# EAGLE design CC3200MOD (EAGLE 7.1.0)
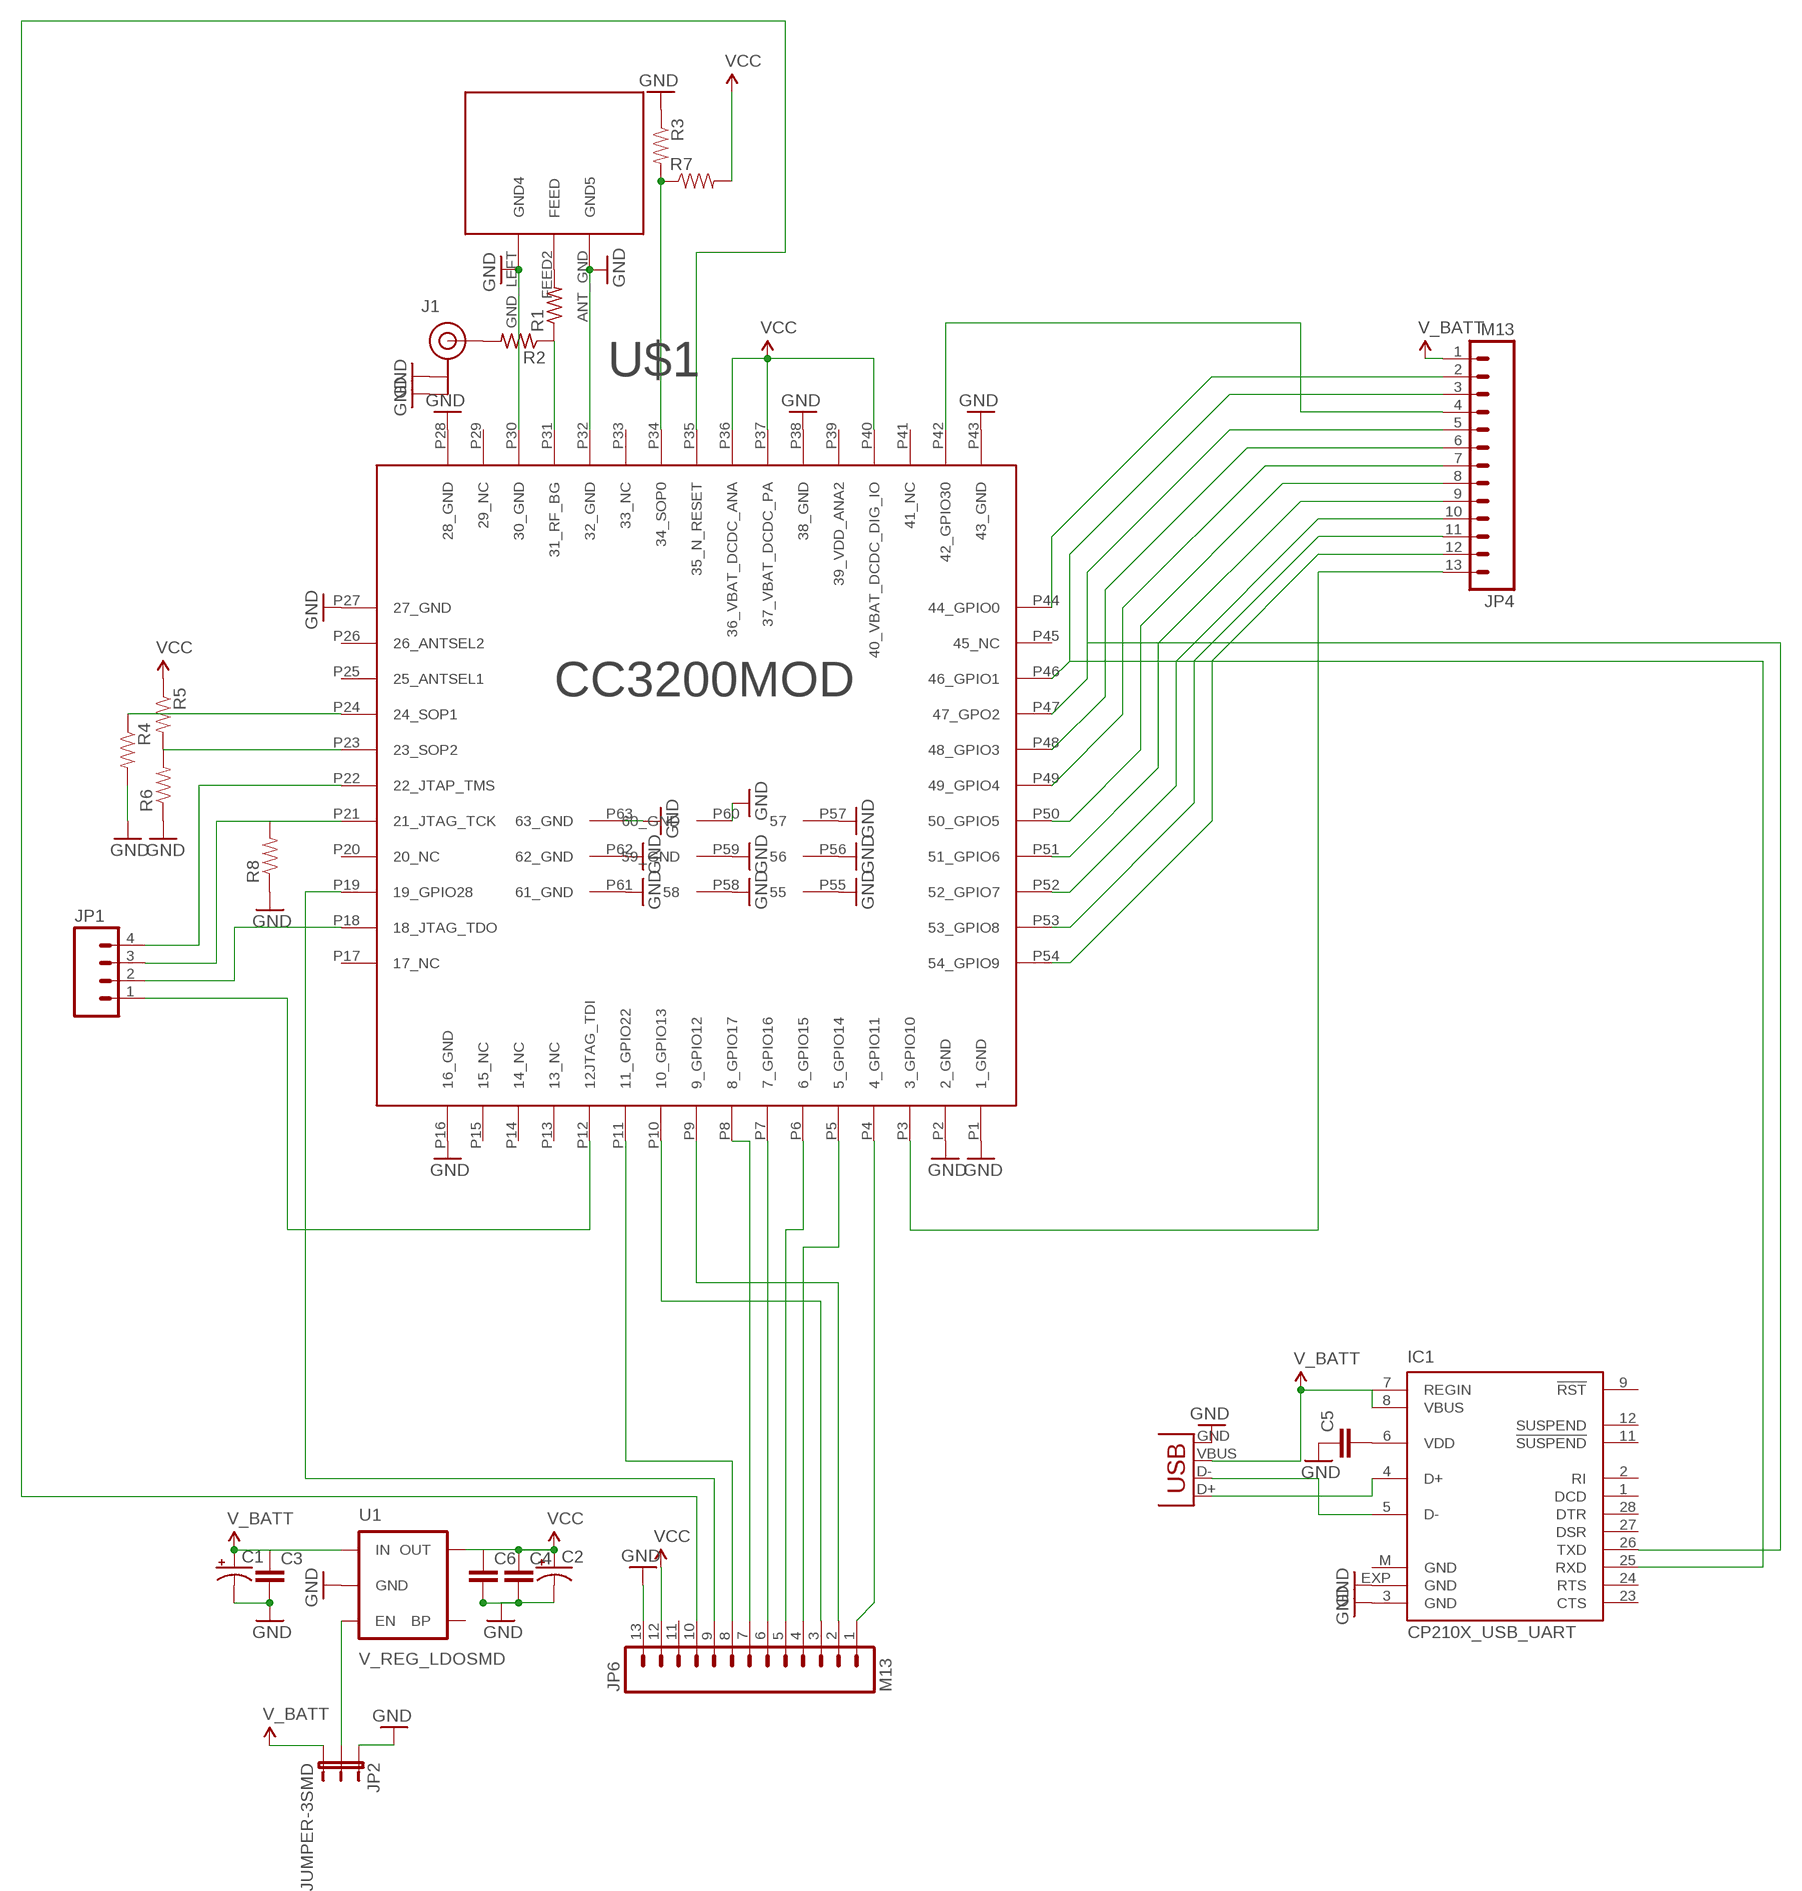
[diagram p0: schematic, sheet 1]

## Parts
C1  CAP_POL1206  [EIA3216]
C2  CAP_POL1206  [EIA3216]
C3  CAP0805  [0805]
C4  CAP0805  [0805]
C5  CAP0805  [0805]
C6  CAP0805  [0805]
IC1  CP210X_USB_UART  [MLP28]
J1  U.FL  [U.FL]
JP1  M041.27MM  [1X04-1.27MM]
JP2  JUMPER-3SMD  [SJ_3]
JP4  M13  [1X13]
JP5  USBSMD  [USB-MINIB]
JP6  M13  [1X13]
R1  R-US_R0402  [R0402]
R2  R-US_R0402  [R0402]
R3  RESISTOR0805-RES  [0805]
R4  RESISTOR0805-RES  [0805]
R5  RESISTOR0805-RES  [0805]
R6  RESISTOR0805-RES  [0805]
R7  RESISTOR0805-RES  [0805]
R8  RESISTOR0805-RES  [0805]
U1  V_REG_LDOSMD  [SOT23-5]
U$1  CC3200  [CC3200MOD]
U$2  ANT  [ANT]

## Nets
GND [power]: C1.C(-) C2.C(-) C3.2 C4.2 C5.1 C6.2 IC1.3(GND) IC1.EXP(GND) J1.P$1(GND) J1.P$2(GND) JP2.1 JP5.GND JP6.13 R3.1 R4.2 R6.1 R8.1 U1.2(GND) U$1.P1(1_GND) U$1.P2(2_GND) U$1.P16(16_GND) U$1.P27(27_GND) U$1.P28(28_GND) U$1.P30(30_GND) U$1.P32(32_GND) U$1.P38(38_GND) U$1.P43(43_GND) U$1.P55 U$1.P56 U$1.P57 U$1.P58 U$1.P59(59_GND) U$1.P60(60_GND) U$1.P61(61_GND) U$1.P62(62_GND) U$1.P63(63_GND) U$2.ANT_GND(GND5) U$2.GND_LEFT(GND4)
N$1: R1.2 U$2.FEED2(FEED)
N$2: JP1.3 R8.2 U$1.P21(21_JTAG_TCK)
N$3: JP1.4 U$1.P22(22_JTAP_TMS)
N$4: R1.1 R2.1 U$1.P31(31_RF_BG)
N$5: J1.P$3(SIGNAL) R2.2
N$6: R4.1 U$1.P24(24_SOP1)
N$7: JP4.2 U$1.P44(44_GPIO0)
N$8: R3.2 R7.1 U$1.P34(34_SOP0)
N$9: JP1.2 U$1.P18(18_JTAG_TDO)
N$10: JP1.1 U$1.P12(12JTAG_TDI)
N$11: R5.2 R6.2 U$1.P23(23_SOP2)
N$12: IC1.25(RXD) JP4.3 U$1.P46(46_GPIO1)
N$13: IC1.26(TXD) JP4.5 U$1.P47(47_GPO2)
N$14: JP4.6 U$1.P48(48_GPIO3)
N$15: JP4.7 U$1.P49(49_GPIO4)
N$16: JP4.8 U$1.P50(50_GPIO5)
N$17: JP4.9 U$1.P51(51_GPIO6)
N$18: JP4.10 U$1.P52(52_GPIO7)
N$19: JP4.11 U$1.P53(53_GPIO8)
N$20: JP4.12 U$1.P54(54_GPIO9)
N$21: JP4.13 U$1.P3(3_GPIO10)
N$22: IC1.4(D+) JP5.D+
N$23: JP6.2 U$1.P9(9_GPIO12)
N$24: JP2.2 U1.3(EN)
N$25: JP4.4 U$1.P42(42_GPIO30)
N$26: JP6.4 U$1.P5(5_GPIO14)
N$27: JP6.5 U$1.P6(6_GPIO15)
N$28: JP6.1 U$1.P4(4_GPIO11)
N$29: JP6.6 U$1.P7(7_GPIO16)
N$30: IC1.5(D-) JP5.D-
N$31: JP6.10 U$1.P35(35_N_RESET)
N$32: JP6.9 U$1.P19(19_GPIO28)
N$33: JP6.7 U$1.P8(8_GPIO17)
N$35: JP6.8 U$1.P11(11_GPIO22)
N$37: C5.2 IC1.6(VDD)
N$38: JP6.3 U$1.P10(10_GPIO13)
V_BATT [power]: C1.A(+) C3.1 IC1.7(REGIN) IC1.8(VBUS) JP2.3 JP4.1 JP5.VBUS U1.1(IN)
VCC [power]: C2.A(+) C4.1 C6.1 JP6.12 R5.1 R7.2 U1.5(OUT) U$1.P36(36_VBAT_DCDC_ANA) U$1.P37(37_VBAT_DCDC_PA) U$1.P40(40_VBAT_DCDC_DIG_IO)
Unconnected: IC1.1(DCD) IC1.2(RI) IC1.9(!RST) IC1.11(!SUSPEND) IC1.12(SUSPEND) IC1.23(CTS) IC1.24(RTS) IC1.27(DSR) IC1.28(DTR) JP6.11 U1.4(BP) U$1.P13(13_NC) U$1.P14(14_NC) U$1.P15(15_NC) U$1.P17(17_NC) U$1.P20(20_NC) U$1.P25(25_ANTSEL1) U$1.P26(26_ANTSEL2) U$1.P29(29_NC) U$1.P33(33_NC) U$1.P39(39_VDD_ANA2) U$1.P41(41_NC) U$1.P45(45_NC)

## Power pins joined to a net without a drawn wire
GND: IC1.M(GND)

## Library data of the parts
C1 C2 = SparkFun-Passives:CAP_POL: Capacitor Polarized These are standard SMD and PTH capacitors. Normally 10uF, 47uF, and 100uF in electrolytic and tantalum varieties. Always verify the external diameter of the through hole cap, it varies with capacity, voltage, and manufacturer. The EIA devices should be standard.
C3-C6 = SparkFun-Passives:CAP: Capacitor Standard 0603 ceramic capacitor, and 0.1" leaded capacitor.
IC1 = SparkFun-DigitalIC:CP210X_USB_UART: Single-Chip USB to UART Bridge Source: www.silabs.com .. CP2101.pdf / cp2102.pdf. Spark Fun Electronics SKU : COM-00310
J1 = SparkFun-Connectors:U.FL: SMD antenna connector- WRL-09144
JP1 = SparkFun-Connectors:M04: Header 4 Standard 4-pin 0.1" header. Use with straight break away headers (SKU : PRT-00116), right angle break away headers (PRT-00553), swiss pins (PRT-00743), machine pins (PRT-00117), and female headers (PRT-00115). Molex polarized connector foot print use with SKU : PRT-08231 with associated crimp pins and housings. 1MM SMD Version SKU: PRT-10208
JP2 = SparkFun-Passives:JUMPER-3
JP4 JP6 = SparkFun-Connectors:M13: 13-pin single row .1" header
JP5 = SparkFun-Connectors:USB: USB Connectors USB-B-PTH is fully proven SKU : PRT-00139/CONN-08278 USB-miniB is fully proven SKU : PRT-00587 USB-A-PCB is untested. USB-A-H is throughly reviewed, but untested. Spark Fun Electronics SKU : PRT-00437 USB-B-SMT is throughly reviewed, but untested. Needs silkscreen touching up. USB-A-S has not been used/tested USB-MB-H has not been used/tested USB-MICROB has been used. CONN-09505
R1 R2 = adafruit:R-US_: RESISTOR, American symbol
R3-R8 = SparkFun-Resistors:RESISTOR: Resistor Basic schematic elements and footprints for 0603, 1206, and PTH resistors.
U1 = SparkFun-PowerIC:V_REG_LDO: Voltage Regulator LDO Standard 150mA LDO voltage regulator in SOT-23 layout. Micrel part MIC5205. BP (by-pass) pin is used to lower output noise with 470pF cap.
U$1 = cc3200mod:CC3200
U$2 = Antenna:ANT

## Net classes
1 power: width 0.381 mm

## Board
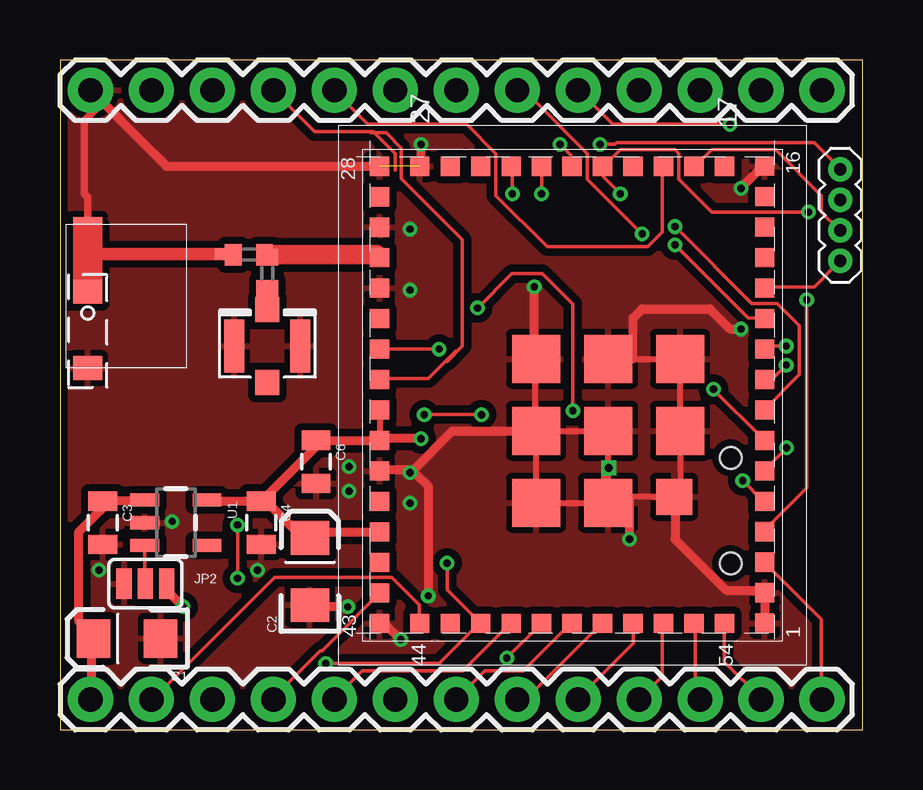
[diagram p1: board, top side]
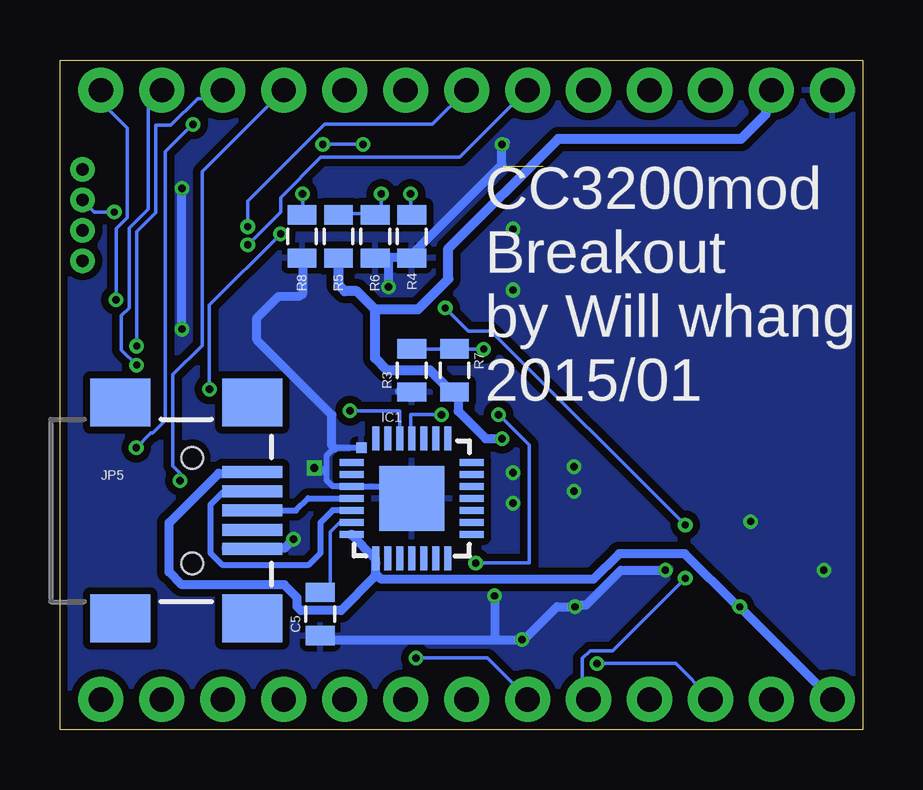
[diagram p2: board, bottom side, seen from below]

Size 33.45 x 27.93 mm. Coordinates in mm from the lower left corner, seen from the top.
Outline: 0,0 33.45,0 33.45,27.93 0,27.93 0,0
Copper layers (1*16): Top 0.035mm / dielectric 1.5mm / Bottom 0.035mm
Design rules "SeeedStudio_2layer_DRU_no_angle_20140221": minimum track width 6mil, minimum drill 12mil, track to track 6mil, track to pad 6mil, pad to pad 6mil, via to via 6mil, smd to smd 0mil, copper to edge 10mil, drill to drill 10mil, minimum pad ring 10mil, minimum via ring 6mil, stop-mask expansion 2mil, vias tented up to drill 100mil, thermal gap 10mil

### Footprints (pad centres in the part's own frame; a part is rotated, then mirrored left to right if it is on the bottom)
EIA3216 = smd 1.4 x 1.6: A 1.4,0; C -1.4,0
0805 = smd 0.8 x 1.2: 1 -0.9,0; 2 0.9,0
MLP28 = smd 1 x 0.3: 1 -2.5,1.5; 2 -2.5,1; 3 -2.5,0.5; 4 -2.5,0; 5 -2.5,-0.5; 6 -2.5,-1; 7 -2.5,-1.5; 15 2.5,-1.5; 16 2.5,-1; 17 2.5,-0.5; 18 2.5,0; 19 2.5,0.5; 20 2.5,1; 21 2.5,1.5 | smd 0.3 x 1: 8 -1.5,-2.5; 9 -1,-2.5; 10 -0.5,-2.5; 11 0,-2.5; 12 0.5,-2.5; 13 1,-2.5; 14 1.5,-2.5; 22 1.5,2.5; 23 1,2.5; 24 0.5,2.5; 25 0,2.5; 26 -0.5,2.5; 27 -1,2.5; 28 -1.5,2.5 | smd 2.7 x 2.7: EXP 0,0 | smd 0.435 x 0.435: M -2.103,2.103
U.FL = smd 2.2 x 0.85: P$1 0,1.375; P$2 0,-1.375 | smd 1.05 x 1: P$3 1.525,0; P$4 -1.525,0
1X04-1.27MM = drill 0.508 pad 1: 1 0,0; 2 1.27,0; 3 2.54,0; 4 3.81,0
SJ_3 = smd 0.635 x 1.27: 1 -0.889,0; 2 0,0; 3 0.889,0
1X13 = drill 1.016 pad 1.88: 1 0,0; 2 2.54,0; 3 5.08,0; 4 7.62,0; 5 10.16,0; 6 12.7,0; 7 15.24,0; 8 17.78,0; 9 20.32,0; 10 22.86,0; 11 25.4,0; 12 27.94,0; 13 30.48,0
USB-MINIB = smd 2.5 x 0.5: D+ 2.5,0; D- 2.5,0.8; GND 2.5,-1.6; ID 2.5,-0.8; VBUS 2.5,1.6 | smd 2.5 x 2: MTN1 -3,4.5; MTN2 2.5,4.5; MTN3 -3,-4.5; MTN4 2.5,-4.5 | hole 0.9: 0,2.2; 0,-2.2
R0402 = smd 0.7 x 0.9: 1 -0.65,0; 2 0.65,0
SOT23-5 = smd 0.55 x 1.2: 1 -0.95,-1.3; 2 0,-1.3; 3 0.95,-1.3; 4 0.95,1.3; 5 -0.95,1.3
CC3200MOD = smd 0.8 x 0.8: P1 9.52,8.025; P2 8.25,8.025; P3 6.98,8.025; P4 5.71,8.025; P5 4.44,8.025; P6 3.17,8.025; P7 1.9,8.025; P8 0.63,8.025; P9 -0.64,8.025; P10 -1.91,8.025; P11 -3.18,8.025; P12 -4.45,8.025; P13 -5.72,8.025; P14 -6.99,8.025; P15 -8.26,8.025; P16 -9.53,8.025; P17 -9.525,6.35; P18 -9.525,5.08; P19 -9.525,3.81; P20 -9.525,2.54; P21 -9.525,1.27; P22 -9.525,0; P23 -9.525,-1.27; P24 -9.525,-2.54; P25 -9.525,-3.81; P26 -9.525,-5.08; P27 -9.525,-6.35; P28 -9.525,-8.02; P29 -8.255,-8.02; P30 -6.985,-8.02; P31 -5.715,-8.02; P32 -4.445,-8.02; P33 -3.175,-8.02; P34 -1.905,-8.02; P35 -0.635,-8.02; P36 0.635,-8.02; P37 1.905,-8.02; P38 3.175,-8.02; P39 4.445,-8.02; P40 5.715,-8.02; P41 6.985,-8.02; P42 8.255,-8.02; P43 9.525,-8.02; P44 9.525,-6.35; P45 9.525,-5.08; P46 9.525,-3.81; P47 9.525,-2.54; P48 9.525,-1.27; P49 9.525,0; P50 9.525,1.27; P51 9.525,2.54; P52 9.525,3.81; P53 9.525,5.08; P54 9.525,6.35 | smd 1.5 x 1.5: P55 4.25,4.25 | smd 2 x 2: P56 1.5,-1.5; P57 -1.5,4.5; P58 4.5,1.5; P59 1.5,1.5; P60 -1.5,1.5; P61 4.5,-1.5; P62 1.5,4.5; P63 -1.5,-1.5
ANT = smd 1 x 1.2: ANT_FEED 2.8,0.9; ANT_GND 6,0.9 | smd 0.5 x 0.5: FEED2 1.25,6.45 | smd 0.3 x 1.2: GND_LEFT -0.15,0.9

### Placement (x,y rotation side)
C1  2.79,3.81 180 top
C2  10.41,6.6 90 top
C3  1.78,8.64 270 top
C4  8.38,8.64 270 top
C5  22.61,4.83 90 bottom
C6  10.67,11.18 270 top
IC1  18.8,9.65 0 bottom
J1  8.64,16 90 top
JP1  32.51,19.56 90 top
JP2  3.56,6.1 0 top
JP4  1.27,1.27 0 top
JP5  27.94,9.14 0 bottom
JP6  31.75,26.67 180 top
R1  7.87,19.81 180 top
R2  8.64,19.05 270 top
R3  18.8,14.99 90 bottom
R4  18.8,20.57 270 bottom
R5  21.84,20.57 90 bottom
R6  20.32,20.57 90 bottom
R7  17.02,14.99 270 bottom
R8  23.37,20.57 90 bottom
U1  4.83,8.64 270 top
U$1  21.34,13.97 270 top
U$2  0.25,21.08 270 top

### Tracks (layer width: path | path; a pad name or v marks a point on that pad's centre or on a via)
GND  (via drill 0.3, 0.33)  (1 unrouted)
  Top 0.254: U$1.P56 U$1.P59 U$1.P58 U$1.P61 19.84,12.42 19.81,12.45 19.81,15.45 U$1.P63 | 22.81,15.45 U$1.P60 23.88,15.47 25.38,15.47 25.4,15.49 25.81,15.49 U$1.P57 U$1.P62 25.84,9.97 U$1.P55 22.67,9.72 | 22.67,9.72 22.61,9.65 | 22.67,9.72 22.67,10.74 v22.86,10.92
  Top 0.305: U$2.GND_LEFT 1.15,22.21 1.02,22.35 1.02,25.4 1.78,26.16 | 1.52,26.67 JP6.13 3.3,24.64
  Top 0.381: C3.2 | U$1.P43 13.51,4.45 v14.2,3.76 | v11.99,5.13 10.16,5.13 C2.C | 7.95,7.57 C4.2 | U$1.P1 29.36,4.52 29.36,5.66 U$1.P2 29.21,5.82 27.76,5.82 25.63,7.95 25.63,9.63 U$1.P55 | v28.37,22.58 29.29,23.5 U$1.P16 | v28.37,16.71 27.92,16.71 27.08,17.55 24.26,17.55 23.88,17.17 23.88,15.47 | 14.73,10.85 13.51,10.85 U$1.P38 | 14.73,10.85 16.33,12.45 19.76,12.45 U$1.P56 | v23.72,7.95 23.72,9.63 U$1.P58 | v15.34,5.59 15.34,10.16 14.81,10.69 14.73,10.85 | v19.76,18.47 19.76,15.57 U$1.P63 | v15.04,24.41 15.04,23.5 U$1.P27 | U$1.P28 4.45,23.5 3.3,24.64 1.78,26.16 JP6.13
  Bottom 0.254: IC1.EXP 19.3,10.15 IC1.3 22.1,10.16 22.35,10.41 22.35,10.67 | IC1.M 22.03,11.75 22.35,11.43 22.35,10.67 | v22.86,10.92 22.61,10.92 22.35,10.67
  Bottom 0.381: 15.34,3.76 22.43,3.76 22.58,3.91 C5.1 | 15.34,3.76 v14.2,3.76 14.05,3.83 12.75,5.13 v11.99,5.13 11.84,5.21 11.53,5.21 10.08,6.66 v8.23,6.66 | 19.3,14.12 18.85,14.12 R3.1 | R8.1 23.34,19.61 23.34,18.16 23.5,18.09 24.33,18.09 25.25,17.17 25.25,16.26 22.12,13.13 22.12,11.84 22.03,11.75 | v28.37,16.71 v28.37,22.58 | v23.72,7.95 24.11,7.57 25.4,7.57 JP5.GND | v15.34,5.59 15.34,3.76 | v19.76,18.47 19.76,19.53 R6.1 20.3,19.69 18.92,19.69 R4.2 18.77,19.84 15.04,23.57 v15.04,24.41 14.88,24.49
  other vias: 4.67,8.69 1.63,6.65 12.04,10.97 12.04,9.96 14.58,18.34 14.58,20.88 14.58,10.72 14.58,9.45
  pour Bottom (isolate 0.305): 0.25,27.69 33.53,27.69 33.53,0 0.25,0
  pour Top (isolate 0.305): 0.25,27.69 33.53,27.69 33.53,0 0.25,0
N$1
  Top 0.305: R1.2 6.72,19.81 U$2.FEED2
N$2  (via drill 0.3)
  Top 0.152: 22.66,23.5 22.66,23.04 v23.34,22.35 | 22.66,23.5 23.34,24.18 25.63,24.18 25.78,24.03 25.78,22.96 27.15,21.59 v31.19,21.59 | 22.66,23.5 U$1.P21
  Bottom 0.152: v23.34,22.35 23.34,21.51 R8.2 | v31.19,21.59 32.03,21.59 32.49,22.05 JP1.3
N$3  (via drill 0.3)
  Top 0.152: v20.83,24.41 21.29,23.95 21.29,23.5 U$1.P22 | v22.5,24.41 23.11,24.41 23.19,24.49 31.42,24.49 32.49,23.42 JP1.4
  Bottom 0.152: v22.5,24.41 v20.83,24.41
N$4
  Top 0.305: R2.1 8.64,19.81 | 8.64,19.81 8.64,20.07 8.89,20.07 8.89,19.81 8.64,19.81
  Top 0.61: R2.1 R1.1
  Top 0.813: 8.64,19.81 13.19,19.81 U$1.P31
N$5
  Top 0.61: R2.2 J1.P$3
N$6  (via drill 0.3)
  Top 0.152: v18.85,22.35 18.85,23.5 U$1.P24
  Bottom 0.152: v18.85,22.35 18.85,21.51 R4.1
N$7
  Top 0.152: U$1.P44 14.96,4.45 14.96,5.21 13.82,6.35 8.94,6.35 3.83,1.24 JP4.2
N$8  (via drill 0.3)
  Top 0.152: v15.8,15.88 U$1.P34
  Bottom 0.152: R7.1 18.77,15.88 R3.2 | R7.1 v15.8,15.88 | R7.1
N$9
  Top 0.152: U$1.P18 26.47,23.5 27.15,24.18 29.82,24.18 31.73,22.28 31.73,21.59 32.49,20.83 JP1.2
N$10
  Top 0.152: JP1.1 31.42,18.47 29.36,18.47 U$1.P12
N$11  (via drill 0.3)
  Top 0.152: v20.07,22.35 U$1.P23
  Bottom 0.152: v20.07,22.35 20.07,21.74 20.3,21.51 R6.2 20.37,21.51 21.82,21.51 R5.2
N$12  (via drill 0.3)
  Top 0.152: v11.07,2.77 15.8,2.77 17.48,4.45 U$1.P46 16.13,5.84 v16.13,6.95 | v15.18,13.14 v17.56,13.14
  Bottom 0.152: v11.07,2.77 7.8,2.77 6.35,1.32 JP4.3 | v17.56,13.14 18.83,13.14 18.83,12.19 IC1.25 | v15.18,13.14 13.91,11.88 13.91,6.95 v16.13,6.95
N$13  (via drill 0.3)
  Top 0.152: U$1.P47 18.77,4.45 16.79,2.46 12.6,2.46 11.46,1.32 JP4.5 | v21.37,13.3 21.37,17.75 20.1,19.02 18.83,19.02 v17.4,17.59 | v7.4,6.32 v7.4,8.54
  Bottom 0.152: v21.37,13.3 19.3,13.3 19.3,12.19 IC1.26 | v17.4,17.59 16.45,16.64 15.49,16.64 v7.4,8.54 | v7.4,6.32 10.41,3.3 11.37,3.3 11.68,2.98 11.68,1.4 11.53,1.4 JP4.5
N$14  (via drill 0.3)
  Top 0.152: v18.62,3 U$1.P48
  Bottom 0.152: v18.62,3 15.65,3 13.97,1.32 JP4.6
N$15
  Top 0.152: JP4.7 17.7,2.46 19.3,2.46 21.29,4.45 U$1.P49
N$16
  Top 0.152: U$1.P50 22.58,4.45 19.46,1.32 19.08,1.32 JP4.8
N$17
  Top 0.152: U$1.P51 23.88,3.61 21.59,1.32 JP4.9
N$18
  Top 0.152: JP4.10 25.1,2.23 25.1,4.45 U$1.P52
N$19
  Top 0.152: JP4.11 26.47,1.47 26.47,4.45 U$1.P53
N$20
  Top 0.152: U$1.P54 27.69,2.85 29.21,1.32 JP4.12
N$21
  Top 0.152: U$1.P3 29.36,6.96 31.73,4.6 31.73,1.32 JP4.13
N$22
  Bottom 0.254: JP5.D+ 23.62,9.14 23.11,9.65 IC1.4
N$23  (via drill 0.3)
  Top 0.152: v30.26,15.21 29.78,14.73 29.46,14.73 U$1.P9
  Bottom 0.152: v30.26,15.21 30.89,15.84 30.89,17.27 30.58,17.59 30.58,20.92 29.78,21.72 29.78,26.32 29.46,26.32 JP6.2
N$24
  Top 0.152: U1.3 3.53,7.65 3.53,6.12 JP2.2
N$25
  Top 0.152: U$1.P42 13.28,5.66 10.92,3.3 10.85,3.3 8.87,1.32 JP4.4
N$26  (via drill 0.3)
  Top 0.152: v28.45,10.39 29.29,9.55 U$1.P5
  Bottom 0.152: v28.45,10.39 28.45,10.69 28.75,11 28.75,14.81 27.53,16.03 27.53,23.27 JP6.4
N$27  (via drill 0.3)
  Top 0.152: v30.28,11.76 29.36,10.85 U$1.P6 | v27.92,25.25 23.04,25.25 21.89,26.39 JP6.5
  Bottom 0.152: v30.28,11.76 29.67,12.37 29.59,12.37 29.06,12.9 29.06,24.11 v27.92,25.25
N$28  (via drill 0.3)
  Top 0.152: v31.12,17.93 31.12,10.08 29.36,8.33 U$1.P4
  Bottom 0.152: v31.12,17.93 31.12,20.9 30.66,21.36 30.66,25.1 31.95,26.39 JP6.1
N$29  (via drill 0.3)
  Top 0.152: v27.23,14.2 29.29,12.14 U$1.P7 | v24.26,20.68 21.97,22.96 21.97,24.03 19.61,26.39 19.3,26.39 JP6.6
  Bottom 0.152: v27.23,14.2 27.23,17.7 v24.26,20.68
N$30
  Bottom 0.254: IC1.5 22.09,9.15 22.61,8.64 22.61,7.37 23.11,6.86 26.67,6.86 27.18,7.37 27.18,9.4 26.67,9.91 25.48,9.91 JP5.D-
N$31
  Top 0.152: 16.49,15.8 16.09,15.41 | 16.09,15.41 15.34,14.66 13.36,14.66 U$1.P35 | 13.97,23.34 13.97,24.03 13.06,24.94 12.95,24.94 | 12.95,24.94 10.62,24.94 JP6.10 | 16.09,15.41 16.13,15.37 16.76,16 16.76,20.45 14.22,22.99 14.22,24.26 13.59,24.89 12.95,24.89 12.95,24.94
N$32
  Top 0.152: U$1.P19 25.1,23.5 25.1,20.75 24.49,20.14 20.3,20.14 18.16,22.28 18.16,24.03 16.94,25.25 12.83,25.25 11.68,26.39 JP6.9
N$33  (via drill 0.3)
  Top 0.152: v25.63,20.98 28.83,17.78 29.9,17.78 30.81,16.87 30.81,14.81 29.36,13.36 U$1.P8
  Bottom 0.152: v25.63,20.98 25.63,22.05 22.43,25.25 17.93,25.25 JP6.7
N$35  (via drill 0.3)
  Top 0.152: v25.63,20.22 28.68,17.17 29.29,17.17 U$1.P11
  Bottom 0.152: v25.63,20.22 24.26,21.59 24.26,22.2 22.58,23.88 16.79,23.88 14.28,26.39 JP6.8
N$37
  Bottom 0.152: IC1.6 21.36,8.64 21.82,8.64 22.2,8.25 22.2,6.12 22.58,5.74 C5.2
N$38  (via drill 0.3)
  Top 0.152: v30.26,16 29.46,16 U$1.P10
  Bottom 0.152: v30.26,16 30.26,20.77 29.46,21.56 29.46,25.21 28.83,25.21 27.72,26.32 26.92,26.32 JP6.3
V_BATT  (via drill 0.3)
  Top 0.381: U1.1 3.45,9.55 1.78,9.55 C3.1 1.7,9.4 1.7,9.17 0.79,8.25 0.79,4.52 1.32,3.99 C1.A 1.32,3.76 1.32,1.32 JP4.1 | JP2.3 4.45,5.82 v5.13,5.13
  Bottom 0.381: IC1.7 21.29,8.1 20.37,7.19 IC1.8 20.3,6.96 20.3,6.5 | JP4.1 v5.13,5.13 5.28,5.21 7.42,7.34 10.16,7.34 11.23,6.27 20.07,6.27 20.3,6.5 | JP5.VBUS 25.48,10.69 26.85,10.69 28.91,8.64 28.91,6.58 28.37,6.04 24.11,6.04 23.57,5.51 23.57,5.13 23.42,4.98 21.74,4.98 20.37,6.35 20.3,6.5
VCC  (via drill 0.3)
  Top 0.254: U$1.P36 U$1.P37
  Top 0.381: U1.5 6.2,9.55 7.87,9.55 C4.1 8.03,9.47 8.64,9.47 | U$1.P40 10.39,8.25 10.16,8.03 C2.A 10.01,8.1 8.64,9.47 | 8.64,9.47 8.71,9.63 8.71,9.86 10.62,11.76 10.62,11.91 C6.1 10.69,12.07 U$1.P37 13.44,12.14 v15.04,12.14
  Bottom 0.381: 21.82,19.61 R5.1 | v15.04,12.14 15.72,12.14 16.87,13.28 16.87,13.97 R7.2
  Bottom 0.406: R7.2 17.13,14.09 18.03,14.99 19.81,14.99 20.32,15.49 20.32,17.53 | 20.32,17.53 21.08,18.29 21.59,18.29 21.84,18.54 R5.1 | JP6.12 4.06,25.65 5.08,24.64 12.7,24.64 17.27,20.07 17.27,18.8 18.54,17.53 20.32,17.53

### Text on the board
bPlace: CC3200mod / Breakout / by Will whang / 2015/01